# Altium schematic sheet cpu.SchDoc
size A3; DocumentNumber: 3; Revision: V1.0; SheetNumber: 3; SheetTotal: 9
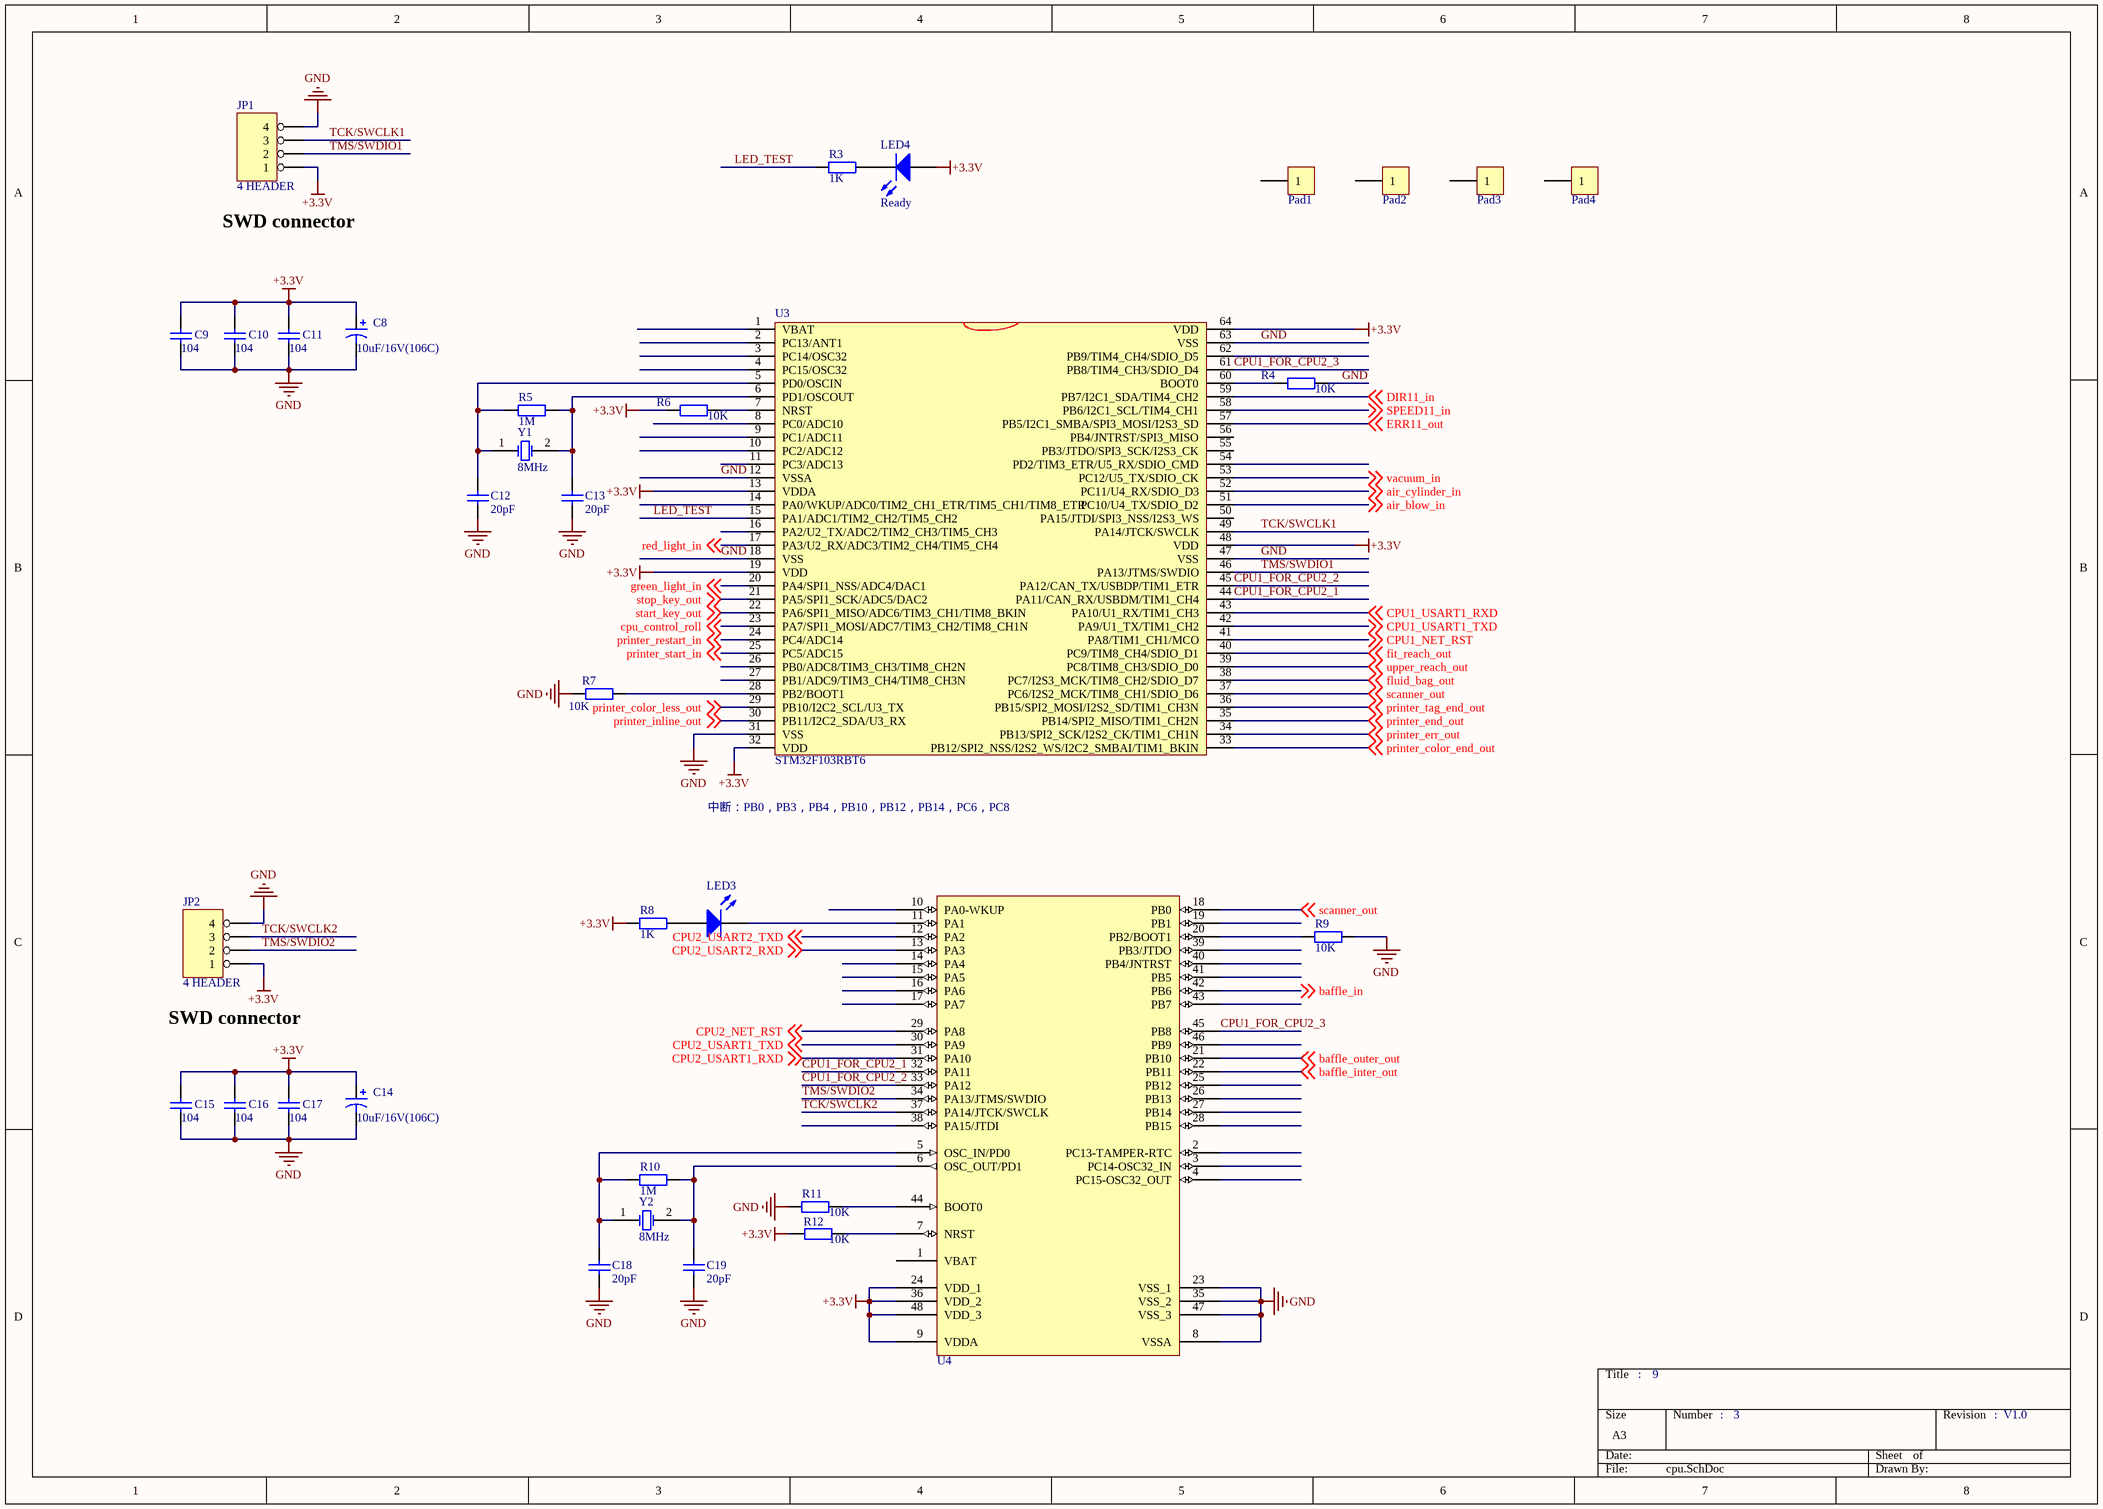
[diagram p0: cpu.SchDoc]

## Parts
C8  value 10uF/16V(106C)  [CAP A-3216]  (hidden comment: Cap Pol3)
C9  value 104  [0805]  (hidden comment: Cap)
C10  value 104  [0805]  (hidden comment: Cap)
C11  value 104  [0805]  (hidden comment: Cap)
C12  value 20pF  [0805]  (hidden comment: Cap)
C13  value 20pF  [0805]  (hidden comment: Cap)
C14  value 10uF/16V(106C)  [CAP A-3216]  (hidden comment: Cap Pol3)
C15  value 104  [0805]  (hidden comment: Cap)
C16  value 104  [0805]  (hidden comment: Cap)
C17  value 104  [0805]  (hidden comment: Cap)
C18  value 20pF  [0805]  (hidden comment: Cap)
C19  value 20pF  [0805]  (hidden comment: Cap)
JP1  4 HEADER  [CON4_1.5]
JP2  4 HEADER  [CON4_1.5]
LED3  (no value)  [LED-0805]
LED4  Ready  [LED-0805]
Pad1  Pad  [pad35]  (value not drawn)
Pad2  Pad  [pad35]  (value not drawn)
Pad3  Pad  [pad35]  (value not drawn)
Pad4  Pad  [pad35]  (value not drawn)
R3  value 1K  [0805]  (hidden comment: Res2)
R4  value 10K  [0805]  (hidden comment: Res2)
R5  value 1M  [0805]  (hidden comment: Res2)
R6  value 10K  [0805]  (hidden comment: Res2)
R7  value 10K  [0805]  (hidden comment: Res2)
R8  value 1K  [0805]  (hidden comment: Res2)
R9  value 10K  [0805]  (hidden comment: Res2)
R10  value 1M  [0805]  (hidden comment: Res2)
R11  value 10K  [0805]  (hidden comment: Res2)
R12  value 10K  [0805]  (hidden comment: Res2)
U3  STM32F103RBT6  [LQFP64]
U4  STM32F103C8T6  [LQFP48]  (value not drawn)
Y1  8MHz  [XTAL_US]
Y2  8MHz  [XTAL_US]

## Nets
+3.3V: C8.1 C9.2 C10.2 C11.2 C14.1 C15.2 C16.2 C17.2 JP1.1 JP2.1 LED4.1(A) R6.1 R8.2 R12.1 U3.13(VDDA) U3.19(VDD) U3.32(VDD) U3.48(VDD) U3.64(VDD) U4.9(VDDA) U4.24(VDD_1) U4.36(VDD_2) U4.48(VDD_3)
GND: C8.2 C9.1 C10.1 C11.1 C12.1 C13.1 C14.2 C15.1 C16.1 C17.1 C18.1 C19.1 JP1.4 JP2.4 R4.2 R7.1 R9.2 R11.1 U3.12(VSSA) U3.18(VSS) U3.31(VSS) U3.47(VSS) U3.63(VSS) U4.8(VSSA) U4.23(VSS_1) U4.35(VSS_2) U4.47(VSS_3)
air_blow_in: U3.51(PC10/U4_TX/SDIO_D2) ; off-sheet air_blow_in
air_cylinder_in: U3.52(PC11/U4_RX/SDIO_D3) ; off-sheet air_cylinder_in
baffle_in: U4.42(PB6) ; off-sheet baffle_in
baffle_inter_out: U4.22(PB11) ; off-sheet baffle_inter_out
baffle_outer_out: U4.21(PB10) ; off-sheet baffle_outer_out
CPU1_FOR_CPU2_1: U3.44(PA11/CAN_RX/USBDM/TIM1_CH4) U4.32(PA11)
CPU1_FOR_CPU2_2: U3.45(PA12/CAN_TX/USBDP/TIM1_ETR) U4.33(PA12)
CPU1_FOR_CPU2_3: U3.61(PB8/TIM4_CH3/SDIO_D4) U4.45(PB8)
CPU1_NET_RST: U3.41(PA8/TIM1_CH1/MCO) ; off-sheet CPU1_NET_RST
CPU1_USART1_RXD: U3.43(PA10/U1_RX/TIM1_CH3) ; off-sheet CPU1_USART1_RXD
CPU1_USART1_TXD: U3.42(PA9/U1_TX/TIM1_CH2) ; off-sheet CPU1_USART1_TXD
CPU2_NET_RST: U4.29(PA8) ; off-sheet CPU2_NET_RST
CPU2_USART1_RXD: U4.31(PA10) ; off-sheet CPU2_USART1_RXD
CPU2_USART1_TXD: U4.30(PA9) ; off-sheet CPU2_USART1_TXD
CPU2_USART2_RXD: U4.13(PA3) ; off-sheet CPU2_USART2_RXD
CPU2_USART2_TXD: U4.12(PA2) ; off-sheet CPU2_USART2_TXD
cpu_control_roll: U3.23(PA7/SPI1_MOSI/ADC7/TIM3_CH2/TIM8_CH1N) ; off-sheet cpu_control_roll
DIR11_in: U3.59(PB7/I2C1_SDA/TIM4_CH2) ; off-sheet DIR11_in
ERR11_out: U3.57(PB5/I2C1_SMBA/SPI3_MOSI/I2S3_SD) ; off-sheet ERR11_out
fit_reach_out: U3.40(PC9/TIM8_CH4/SDIO_D1) ; off-sheet fit_reach_out
fluid_bag_out: U3.38(PC7/I2S3_MCK/TIM8_CH2/SDIO_D7) ; off-sheet fluid_bag_out
green_light_in: U3.20(PA4/SPI1_NSS/ADC4/DAC1) ; off-sheet green_light_in
LED_TEST: R3.1 U3.15(PA1/ADC1/TIM2_CH2/TIM5_CH2)
printer_color_end_out: U3.33(PB12/SPI2_NSS/I2S2_WS/I2C2_SMBAI/TIM1_BKIN) ; off-sheet printer_color_end_out
printer_color_less_out: U3.29(PB10/I2C2_SCL/U3_TX) ; off-sheet printer_color_less_out
printer_end_out: U3.35(PB14/SPI2_MISO/TIM1_CH2N) ; off-sheet printer_end_out
printer_err_out: U3.34(PB13/SPI2_SCK/I2S2_CK/TIM1_CH1N) ; off-sheet printer_err_out
printer_inline_out: U3.30(PB11/I2C2_SDA/U3_RX) ; off-sheet printer_inline_out
printer_restart_in: U3.24(PC4/ADC14) ; off-sheet printer_restart_in
printer_start_in: U3.25(PC5/ADC15) ; off-sheet printer_start_in
printer_tag_end_out: U3.36(PB15/SPI2_MOSI/I2S2_SD/TIM1_CH3N) ; off-sheet printer_tag_end_out
red_light_in: U3.17(PA3/U2_RX/ADC3/TIM2_CH4/TIM5_CH4) ; off-sheet red_light_in
scanner_out: U3.37(PC6/I2S2_MCK/TIM8_CH1/SDIO_D6) U4.18(PB0) ; off-sheet scanner_out
SPEED11_in: U3.58(PB6/I2C1_SCL/TIM4_CH1) ; off-sheet SPEED11_in
start_key_out: U3.22(PA6/SPI1_MISO/ADC6/TIM3_CH1/TIM8_BKIN) ; off-sheet start_key_out
stop_key_out: U3.21(PA5/SPI1_SCK/ADC5/DAC2) ; off-sheet stop_key_out
TCK/SWCLK1: JP1.3 U3.49(PA14/JTCK/SWCLK)
TCK/SWCLK2: JP2.3 U4.37(PA14/JTCK/SWCLK)
TMS/SWDIO1: JP1.2 U3.46(PA13/JTMS/SWDIO)
TMS/SWDIO2: JP2.2 U4.34(PA13/JTMS/SWDIO)
upper_reach_out: U3.39(PC8/TIM8_CH3/SDIO_D0) ; off-sheet upper_reach_out
vacuum_in: U3.53(PC12/U5_TX/SDIO_CK) ; off-sheet vacuum_in
NetC12_2: C12.2 R5.1 U3.5(PD0/OSCIN) Y1.1(OSC1)
NetC13_2: C13.2 R5.2 U3.6(PD1/OSCOUT) Y1.2(OSC2)
NetC18_2: C18.2 R10.1 U4.5(OSC_IN/PD0) Y2.1(OSC1)
NetC19_2: C19.2 R10.2 U4.6(OSC_OUT/PD1) Y2.2(OSC2)
NetLED3_1: LED3.1(A) R8.1
NetLED3_2: LED3.2(K) U4.11(PA1)
NetLED4_2: LED4.2(K) R3.2
NetR4_1: R4.1 U3.60(BOOT0)
NetR6_2: R6.2 U3.7(NRST)
NetR7_2: R7.2 U3.28(PB2/BOOT1)
NetR9_1: R9.1 U4.20(PB2/BOOT1)
NetR11_2: R11.2 U4.44(BOOT0)
NetR12_2: R12.2 U4.7(NRST)

Not connected (* = marked no-connect by the designer): Pad1 1; Pad2 1; Pad3 1; Pad4 1; U3 1(VBAT) 2(PC13/ANT1) 3(PC14/OSC32) 4(PC15/OSC32) 8(PC0/ADC10) 9(PC1/ADC11) 10(PC2/ADC12) 11(PC3/ADC13) 14(PA0/WKUP/ADC0/TIM2_CH1_ETR/TIM5_CH1/TIM8_ETR) 16(PA2/U2_TX/ADC2/TIM2_CH3/TIM5_CH3) 26(PB0/ADC8/TIM3_CH3/TIM8_CH2N) 27(PB1/ADC9/TIM3_CH4/TIM8_CH3N) 50(PA15/JTDI/SPI3_NSS/I2S3_WS) 54(PD2/TIM3_ETR/U5_RX/SDIO_CMD) 55(PB3/JTDO/SPI3_SCK/I2S3_CK) 56(PB4/JNTRST/SPI3_MISO) 62(PB9/TIM4_CH4/SDIO_D5); U4 1(VBAT) 2(PC13-TAMPER-RTC) 3(PC14-OSC32_IN) 4(PC15-OSC32_OUT) 10(PA0-WKUP) 14(PA4) 15(PA5) 16(PA6) 17(PA7) 19(PB1) 25(PB12) 26(PB13) 27(PB14) 28(PB15) 38(PA15/JTDI) 39(PB3/JTDO) 40(PB4/JNTRST) 41(PB5) 43(PB7) 46(PB9)

## Notes on the sheet
- (near JP1) SWD connector
- 中断：PB0，PB3，PB4，PB10，PB12，PB14，PC6，PC8
- (near JP2) SWD connector
- :

## Library data of the parts
C8 C14 = Cap Pol3: Polarized Capacitor (Surface Mount); Published: 8-Jun-2000; LatestRevisionDate: 17-Jul-2002; LatestRevisionNote: Re-released for DXP Platform.; PackageReference: C0805; Publisher: Altium Limited
C9-C13 C15-C19 = Cap: Capacitor; Published: 8-Jun-2000; LatestRevisionDate: 17-Jul-2002; LatestRevisionNote: Re-released for DXP Platform.; Publisher: Altium Limited
  C9-C11 C15-C17: PackageReference: RAD-0.3
JP1 JP2 = 4 HEADER: 4 Pin Header
LED3 LED4 = LED2: Typical RED, GREEN, YELLOW, AMBER GaAs LED; Published: 8-Jun-2000; LatestRevisionDate: 17-Jul-2002; LatestRevisionNote: Re-released for DXP Platform.; PackageDocument: Feb-2002; PackageReference: 3.2X1.6X1.1; Publisher: Altium Limited
R3-R12 = Res2: Resistor; Published: 8-Jun-2000; LatestRevisionDate: 17-Jul-2002; LatestRevisionNote: Re-released for DXP Platform.; Publisher: Altium Limited
  R3 R8: PackageReference: AXIAL-0.4
U3 = STM32F103RDT6
Y1 Y2 = XTAL: Crystal Oscillator; Published: 8-Jun-2000; LatestRevisionDate: 17-Jul-2002; LatestRevisionNote: Re-released for DXP Platform.; Publisher: Altium Limited